# Altium schematic sheet Power_Driver_1.SchDoc
size 254 x 203 mm; Author: Aurimas Vilkas; DrawnBy: Aurimas Vilkas; Engineer: Aurimas Vilkas
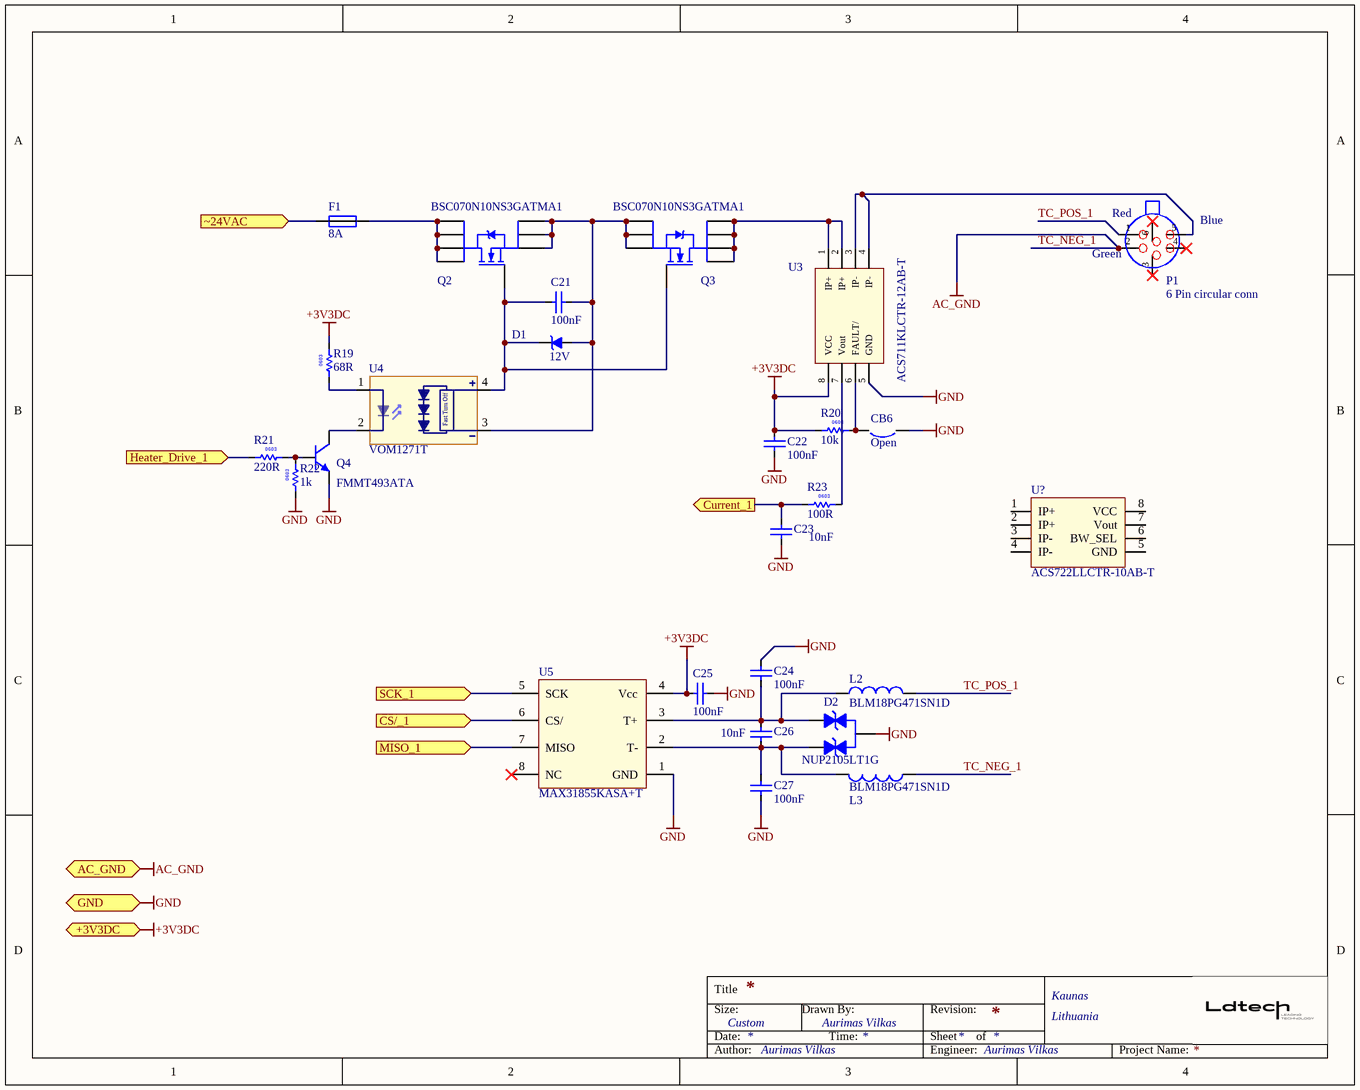
[diagram p0: Power_Driver_1.SchDoc]

## Parts
C21  100nF  [CAPC1608N]
C22  100nF  [CAPC1608N]
C23  10nF  [CAPC1608N]
C24  100nF  [CAPC1608N]
C25  100nF  [CAPC1608N]
C26  10nF  [CAPC1608N]
C27  100nF  [CAPC1608N]
CB6  Open  [CB_0603]
D1  12V  [SOD-80C]
D2  NUP2105LT1G  [SOT23-3]
F1  8A  [1206F]
L2  BLM18PG471SN1D  [LL0603\2P]
L3  BLM18PG471SN1D  [LL0603\2P]
P1  6 Pin circular conn  [RPC1-12RB-6P(71)]
Q2  BSC070N10NS3GATMA1  [PG-TDSON-8]
Q3  BSC070N10NS3GATMA1  [PG-TDSON-8]
Q4  FMMT493ATA  [SOT23-3]
R19  68R  [RESC1608N]
R20  10k  [RESC1608N]
R21  220R  [RESC1608N]
R22  1k  [RESC1608N]
R23  100R  [RESC1608N]
U3  ACS711KLCTR-12AB-T  [SOIC-8]
U4  VOM1271T  [SOP-4]
U5  MAX31855KASA+T  [SOIC-8]
U?  ACS722LLCTR-10AB-T  [SOIC-8]

## Ports
+3V3DC (in), AC_GND (in), CS/_1 (in), Current_1 (out), GND (in), Heater_Drive_1 (in), MISO_1 (in), SCK_1 (in), ~24VAC (in)

## Nets
+3V3DC: C22.2 C25.1 R19.2 R20.1 U3.8(VCC) U5.4(Vcc) ; port +3V3DC
GND: C22.1 C23.2 C24.2 C25.2 C27.1 CB6.1 D2.3 Q4.2(E) R22.1 U3.5(GND) U5.1(GND) ; port GND
TC_NEG_1: L3.1 P1.2 ; port AC_GND  [also labelled AC_GND]
CS/_1: U5.6(CS/) ; port CS/_1
Current_1: C23.1 R23.1 ; port Current_1
Heater_Drive_1: R21.1 ; port Heater_Drive_1
MISO_1: U5.7(MISO) ; port MISO_1
SCK_1: U5.5(SCK) ; port SCK_1
TC_POS_1: L2.2 P1.1
~24VAC: F1.2 ; port ~24VAC
NetC21_1: C21.1 D1.2(A) Q2.3(S) Q3.3(S) U4.3(K)
NetC21_2: C21.2 D1.1(K) Q2.1(G) Q3.1(G) U4.4(E)
NetC24_1: C24.1 C26.1 D2.2 L2.1 U5.3(T+)
NetC26_2: C26.2 C27.2 D2.1 L3.2 U5.2(T-)
NetCB6_2: CB6.2 R20.2 U3.6(FAULT/)
NetF1_1: F1.1 Q2.2(D)
NetP1_5: P1.5 U3.3(IP-) U3.4(IP-)
NetQ3_2: Q3.2(D) U3.1(IP+) U3.2(IP+)
NetQ4_1: Q4.1(B) R21.2 R22.2
NetQ4_3: Q4.3(C) U4.2(K)
NetR19_1: R19.1 U4.1(A)
NetR23_2: R23.2 U3.7(Vout)

Not connected (* = marked no-connect by the designer): P1 3* 4* 6*; U5 8(NC)*; U? 1(IP+) 2(IP+) 3(IP-) 4(IP-) 5(GND) 6(BW_SEL) 7(Vout) 8(VCC)

## Notes on the sheet
- (near P1) Red
- (near P1) Blue
- (near P1) Green
- Title
- Size:
- Date:
- Custom
- Drawn By:
- Time:
- Revision:
- Sheet
- of
- Kaunas
- Lithuania
- Author:
- Engineer:
- Project Name:
- (in symbol R0000002) 0603
- (in symbol R0000008) 0603
- (in symbol R2406048) 0603
- (in symbol R2406056) 0603
- (in symbol VOM1271T) Fast Turn Off

## Library data of the parts
C21 C22 C24 C25 C27 = C0000005: MC0805B104K250CT -  SMD Multilayer Ceramic Capacitor, 0.1 µF, 25 V, 0805 [2012 Metric], ± 10%, X7R, MC Series; Supplier 1: Farnell; Supplier Part Number 1: 1759166
C23 C26 = C0000009: MCU0603R103KCT -  SMD Multilayer Ceramic Capacitor, 10000 pF, 50 V, 0603 [1608 Metric], ± 10%, X7R, MCU Series; Supplier 1: Farnell; Supplier Part Number 1: 9406182
CB6 = CB Open: Circuit Breaker; Revision: July-2002: Re-released for DXP Platform.
D1 = 12V: BZT55C12-GS08 -  Zener Single Diode, 12 V, 500 mW, SOD-80 (MiniMELF), 5 %, 2 Pins, 175 °C; Supplier 1: Farnell; Supplier Part Number 1: 2690028
D2 = NUP2105LT1G: NUP2105LT1G -  TVS Diode, NUP21 Series, Bidirectional, 22 V, 40 V, SOT-23, 3 Pins; Supplier Part number 1: 2101833; Supplier 1: Farnell
F1 = 8A Fuse: MCCFB1206TFF/8 -  Fuse, Surface Mount, 8 A, 32 V, Fast Acting, 1206; Supplier Part Number 1: 2850026; Supplier 1: Farnell
L2 L3 = L0000158: BLM18PG471SN1D -  Ferrite Bead, 0603 [1608 Metric], 470 ohm, 1 A, BLM18P Series, 0.2 ohm, ± 25%; Supplier 1: Farnell; Supplier Part Number 1: 1515745
P1 = RPC1-12RB-6P(71): RPC1-12RB-6P(71) -  Circular Connector, RP Series, Panel Mount Receptacle, 6 Contacts, Solder Pin; Supplier Part Number 1: 1077728; Supplier 1: Farnell
Q2 Q3 = BSC070N10NS3GATMA1: BSC070N10NS3GATMA1 -  Power MOSFET, N Channel, 100 V, 90 A, 0.0063 ohm, TDSON, Surface Mount; Kitron: 4084118; Supplier Part Number 1: 2443421; Supplier 1: Farnell
Q4 = FMMT493ATA: FMMT493ATA -  Bipolar (BJT) Single Transistor, NPN, 60 V, 150 MHz, 500 mW, 1 A, 300 hFE; Supplier Part Number 1: 2061448; Supplier 1: Farnell
R19 = R0000002: MCSR06X68R0FTL -  SMD Chip Resistor, 68 ohm, MCSR 06 Series, 75 V, Ceramic, 0603 [1608 Metric], 100 mW; Supplier 1: Farnell; Supplier Part Number 1: 2074301
R20 = R0000008: MCWR06X1002FTL -  SMD Chip Resistor, 0603 [1608 Metric], 10 kohm, MCWR Series, 50 V, Thick Film, 100 mW; Supplier 1: Farnell; Supplier Part Number 1: 2447230
R21 = R2406056: CRGH0603F220R -  SMD Chip Resistor, 220 ohm, CRG Series, 50 V, Thick Film, 0603 [1608 Metric], 200 mW; Supplier 1: Farnell; Supplier Part Number 1: 2331993
R22 = R2406056: CRGH0603F1K0 -  SMD Chip Resistor, 1 kohm, CRG Series, 50 V, Thick Film, 0603 [1608 Metric], 200 mW; Supplier 1: Farnell; Supplier Part Number 1: 2332003
R23 = R2406048: MCHVR03JTEX1000 -  SMD Chip Resistor, High Voltage, 100 ohm, HVR Series, 200 V, Thick Film, 0603 [1608 Metric], 100 mW; Supplier 1: Farnell; Supplier Part Number 1: 2825696
U3 = ACS711KLCTR-12AB-T: ACS711KLCTR-12AB-T -  Current Sensor, Overcurrent Fault, 4 mA, 100 kHz, SOIC, 8 Pins, 3 V, 5.5 V; Supplier Part Number 1: 2057423; Supplier 1: Farnell
U4 = VOM1271T: VOM1271T -  Photovoltaic MOSFET Driver, Integrated Fast Turn-Off, Solid-State Relay 47µA Out, 24 µs Delay, SOP-4; Supplier Part Number 1: 2395899; Supplier 1: Farnell
U5 = MAX31855KASA+T: MAX31855KASA+T -  Temperature Sensor IC, Thermocouple, Digital, ± 2°C, -200 °C, 1350 °C, NSOIC, 8 Pins; Supplier 1: Farnell; Supplier Part Number 1: 2515622
U? = ACS722LLCTR-10AB-T: SENSOR CURRENT HALL 10A AC/DC; Supplier 1: Digi-Key